# EAGLE board ELE3000.5 (EAGLE 6.1)
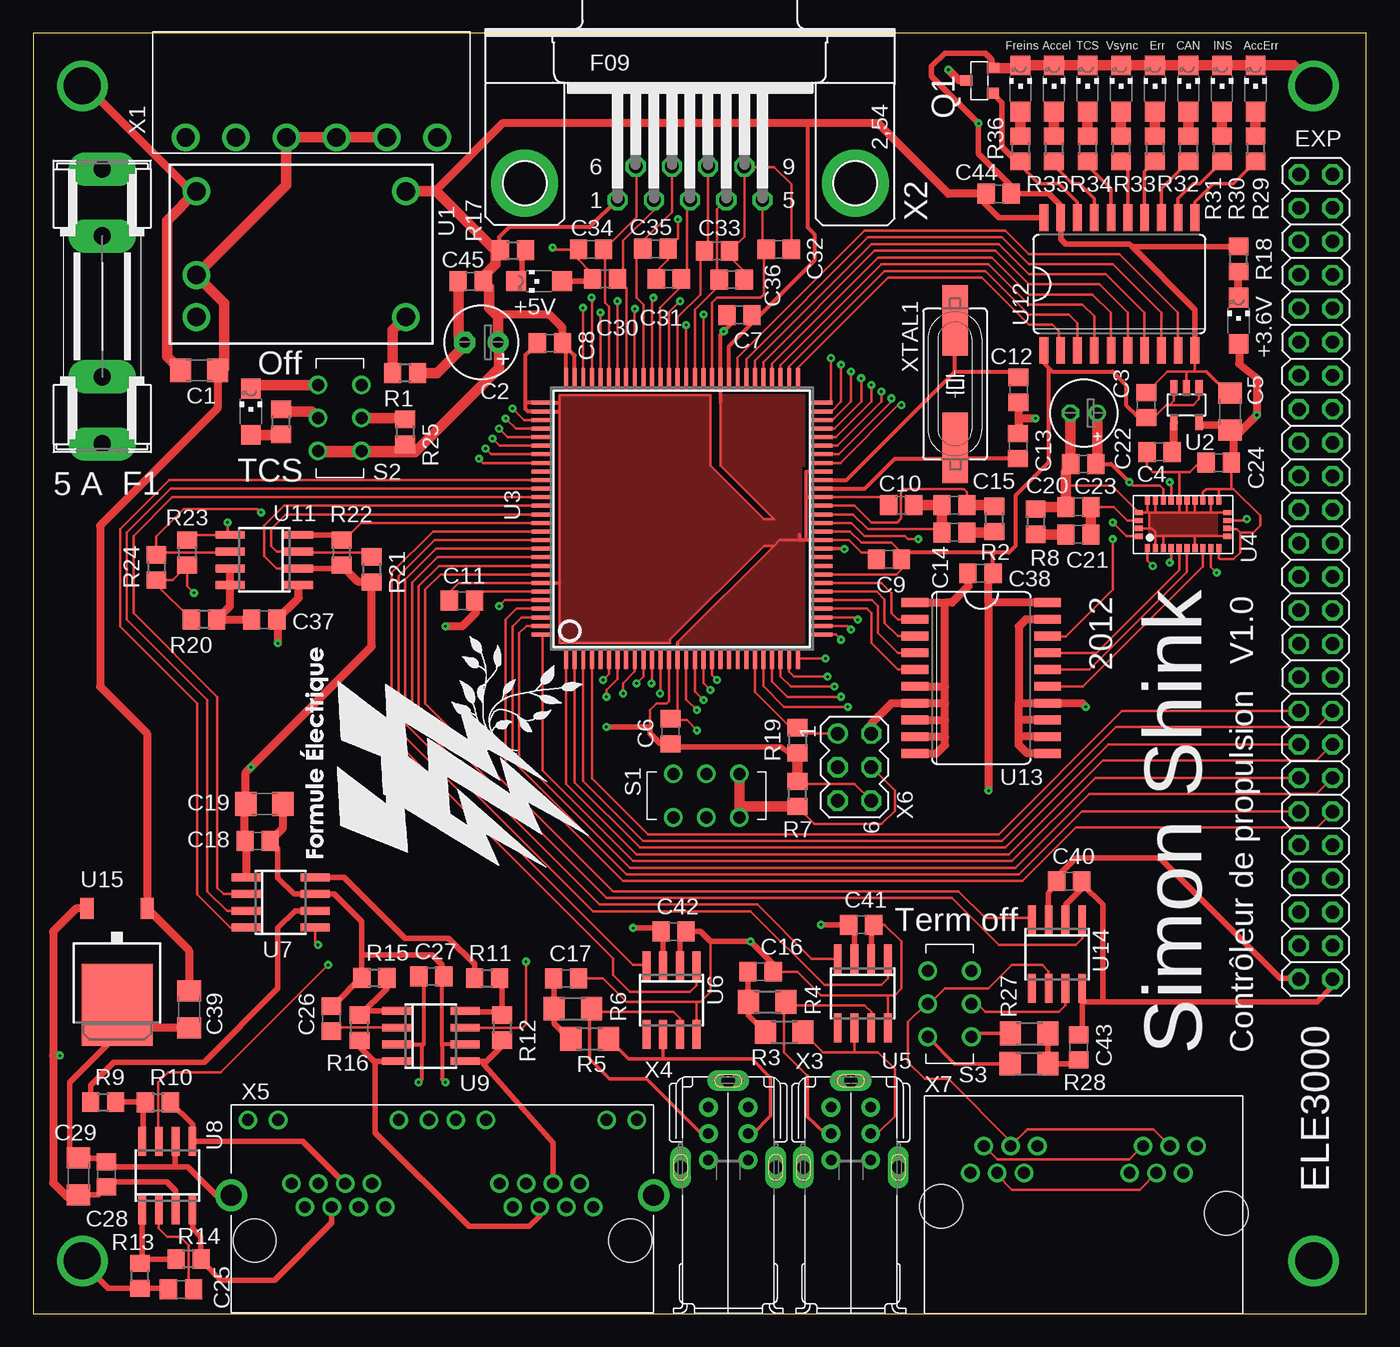
[diagram p5: board, top side]
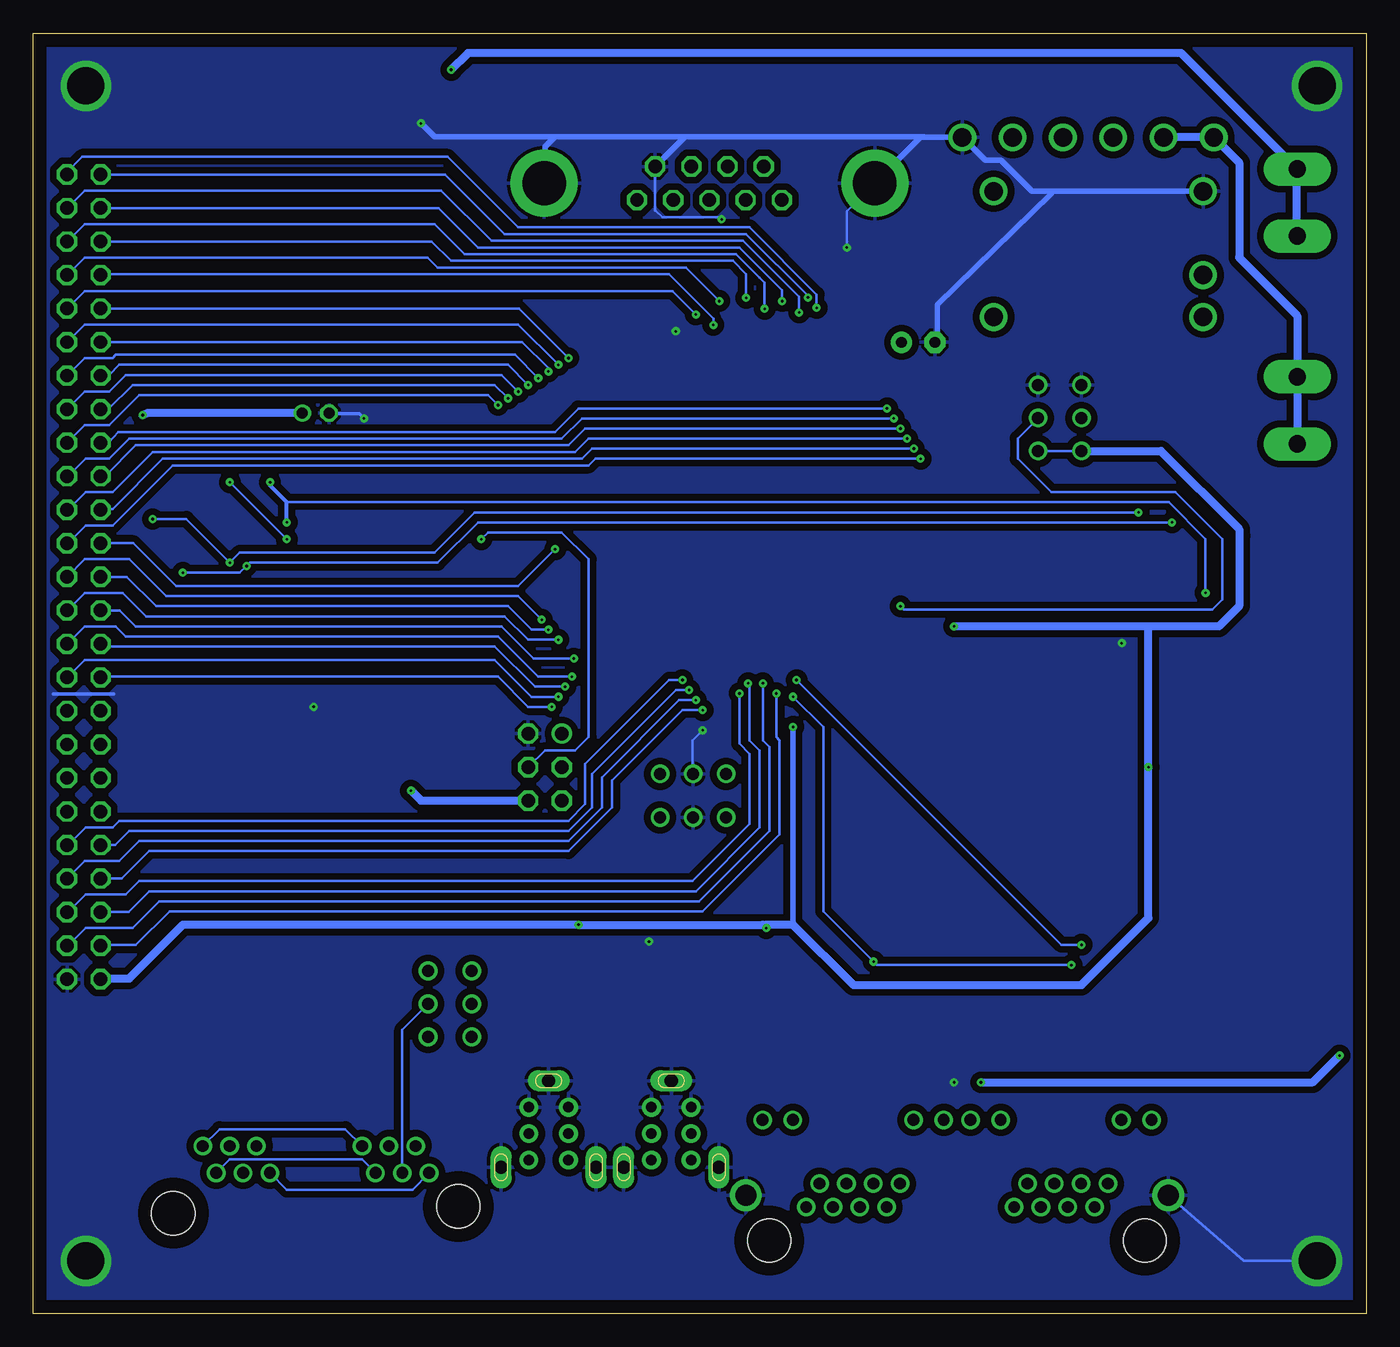
[diagram p6: board, bottom side, seen from below]

Size 101.02 x 97.02 mm. Coordinates in mm from the lower left corner, seen from the top.
Outline: 0,0 101.02,0 101.02,97.02 0,97.02 0,0
Copper layers (1*16): Top 0.035mm / dielectric 1.5mm / Bottom 0.035mm
Design rules: minimum track width 8mil, minimum drill 8mil, track to track 8mil, track to pad 8mil, pad to pad 8mil, via to via 8mil, smd to smd 8mil, copper to edge 40mil, drill to drill 8mil, minimum pad ring 10mil, minimum via ring 8mil, stop-mask expansion 5mil, vias tented up to drill 0mil, thermal gap 10mil

## Footprints (pad centres in the part's own frame; a part is rotated, then mirrored left to right if it is on the bottom)
CHIPLED_1206 = smd 1.5 x 1.5: A 0,-1.75; C 0,1.75
C1206 = smd 1.6 x 1.8: 1 -1.4,0; 2 1.4,0
E2,5-6 = drill 0.813 pad 1.6: + -1.27,0 | drill 0.813 pad 1.6 octagon: - 1.27,0
C0805 = smd 1.3 x 1.5: 1 -0.95,0; 2 0.95,0
E2-5 = drill 0.813 pad 1.27: + -1.016,0 | drill 0.813 pad 1.27 octagon: - 1.016,0
2X25 = drill 1.016 octagon: 1 -30.48,-1.27; 2 -30.48,1.27; 3 -27.94,-1.27; 4 -27.94,1.27; 5 -25.4,-1.27; 6 -25.4,1.27; 7 -22.86,-1.27; 8 -22.86,1.27; 9 -20.32,-1.27; 10 -20.32,1.27; 11 -17.78,-1.27; 12 -17.78,1.27; 13 -15.24,-1.27; 14 -15.24,1.27; 15 -12.7,-1.27; 16 -12.7,1.27; 17 -10.16,-1.27; 18 -10.16,1.27; 19 -7.62,-1.27; 20 -7.62,1.27; 21 -5.08,-1.27; 22 -5.08,1.27; 23 -2.54,-1.27; 24 -2.54,1.27; 25 0,-1.27; 26 0,1.27; 27 2.54,-1.27; 28 2.54,1.27; 29 5.08,-1.27; 30 5.08,1.27; 31 7.62,-1.27; 32 7.62,1.27; 33 10.16,-1.27; 34 10.16,1.27; 35 12.7,-1.27; 36 12.7,1.27; 37 15.24,-1.27; 38 15.24,1.27; 39 17.78,-1.27; 40 17.78,1.27; 41 20.32,-1.27; 42 20.32,1.27; 43 22.86,-1.27; 44 22.86,1.27; 45 25.4,-1.27; 46 25.4,1.27; 47 27.94,-1.27; 48 27.94,1.27; 49 30.48,-1.27; 50 30.48,1.27
SHK20L = drill 1.321 pad 2.54 long: 1A -10.414,0; 1B -5.334,0; 2A 10.414,0; 2B 5.334,0
MICRO3 = smd 0.8 x 0.9: 1 -0.95,-1; 2 0.95,-1; 3 0,1
R0805 = smd 1.3 x 1.5: 1 -0.95,0; 2 0.95,0
R1206 = smd 1.6 x 1.803: 1 -1.422,0; 2 1.422,0
JS202011CQN = drill 0.9: 1 -2.54,2.03; 2 -0.04,2.03; 3 2.46,2.03; 4 -2.54,-1.27; 5 -0.04,-1.27; 6 2.46,-1.27
EUS = drill 1.4: 1 -6.35,6.35; 2 -6.35,0; 3 -6.35,-3.175; 4 9.525,-3.175; 5 9.525,6.35
SOT23-5 = smd 0.55 x 1.2: 1 -0.95,-1.3; 2 0,-1.3; 3 0.95,-1.3; 4 0.95,1.3; 5 -0.95,1.3
SQFP-S-20X20-112 = smd 0.3 x 1.6: 1 -8.775,-10.6; 2 -8.125,-10.6; 3 -7.475,-10.6; 4 -6.825,-10.6; 5 -6.175,-10.6; 6 -5.525,-10.6; 7 -4.875,-10.6; 8 -4.225,-10.6; 9 -3.575,-10.6; 10 -2.925,-10.6; 11 -2.275,-10.6; 12 -1.625,-10.6; 13 -0.975,-10.6; 14 -0.325,-10.6; 15 0.325,-10.6; 16 0.975,-10.6; 17 1.625,-10.6; 18 2.275,-10.6; 19 2.925,-10.6; 20 3.575,-10.6; 21 4.225,-10.6; 22 4.875,-10.6; 23 5.525,-10.6; 24 6.175,-10.6; 25 6.825,-10.6; 26 7.475,-10.6; 27 8.125,-10.6; 28 8.775,-10.6; 57 8.775,10.6; 58 8.125,10.6; 59 7.475,10.6; 60 6.825,10.6; 61 6.175,10.6; 62 5.525,10.6; 63 4.875,10.6; 64 4.225,10.6; 65 3.575,10.6; 66 2.925,10.6; 67 2.275,10.6; 68 1.625,10.6; 69 0.975,10.6; 70 0.325,10.6; 71 -0.325,10.6; 72 -0.975,10.6; 73 -1.625,10.6; 74 -2.275,10.6; 75 -2.925,10.6; 76 -3.575,10.6; 77 -4.225,10.6; 78 -4.875,10.6; 79 -5.525,10.6; 80 -6.175,10.6; 81 -6.825,10.6; 82 -7.475,10.6; 83 -8.125,10.6; 84 -8.775,10.6 | smd 1.6 x 0.3: 29 10.6,-8.775; 30 10.6,-8.125; 31 10.6,-7.475; 32 10.6,-6.825; 33 10.6,-6.175; 34 10.6,-5.525; 35 10.6,-4.875; 36 10.6,-4.225; 37 10.6,-3.575; 38 10.6,-2.925; 39 10.6,-2.275; 40 10.6,-1.625; 41 10.6,-0.975; 42 10.6,-0.325; 43 10.6,0.325; 44 10.6,0.975; 45 10.6,1.625; 46 10.6,2.275; 47 10.6,2.925; 48 10.6,3.575; 49 10.6,4.225; 50 10.6,4.875; 51 10.6,5.525; 52 10.6,6.175; 53 10.6,6.825; 54 10.6,7.475; 55 10.6,8.125; 56 10.6,8.775; 85 -10.6,8.775; 86 -10.6,8.125; 87 -10.6,7.475; 88 -10.6,6.825; 89 -10.6,6.175; 90 -10.6,5.525; 91 -10.6,4.875; 92 -10.6,4.225; 93 -10.6,3.575; 94 -10.6,2.925; 95 -10.6,2.275; 96 -10.6,1.625; 97 -10.6,0.975; 98 -10.6,0.325; 99 -10.6,-0.325; 100 -10.6,-0.975; 101 -10.6,-1.625; 102 -10.6,-2.275; 103 -10.6,-2.925; 104 -10.6,-3.575; 105 -10.6,-4.225; 106 -10.6,-4.875; 107 -10.6,-5.525; 108 -10.6,-6.175; 109 -10.6,-6.825; 110 -10.6,-7.475; 111 -10.6,-8.125; 112 -10.6,-8.775
LGA-28 = smd 0.4 x 0.6: P$1 2.7,1.8; P$2 2.1,1.8; P$3 1.5,1.8; P$4 0.9,1.8; P$5 0.3,1.8; P$6 -0.3,1.8; P$7 -0.9,1.8; P$8 -1.5,1.8; P$9 -2.1,1.8; P$10 -2.7,1.8; P$15 -2.7,-1.8; P$16 -2.1,-1.8; P$17 -1.5,-1.8; P$18 -0.9,-1.8; P$19 -0.3,-1.8; P$20 0.3,-1.8; P$21 0.9,-1.8; P$22 1.5,-1.8; P$23 2.1,-1.8; P$24 2.7,-1.8 | smd 0.6 x 0.4: P$11 -3.35,0.9; P$12 -3.35,0.3; P$13 -3.35,-0.3; P$14 -3.35,-0.9; P$25 3.35,-0.9; P$26 3.35,-0.3; P$27 3.35,0.3; P$28 3.35,0.9
SO08 = smd 0.6 x 2.2: 1 -1.905,-2.6; 2 -0.635,-2.6; 3 0.635,-2.6; 4 1.905,-2.6; 5 1.905,2.6; 6 0.635,2.6; 7 -0.635,2.6; 8 -1.905,2.6
SO-08 = smd 0.6 x 2.2: 1 -1.905,-2.6; 2 -0.635,-2.6; 3 0.635,-2.6; 4 1.905,-2.6; 5 1.905,2.6; 6 0.635,2.6; 7 -0.635,2.6; 8 -1.905,2.6
SO20W = smd 0.66 x 2.032: 1 -5.715,-5.029; 2 -4.445,-5.029; 3 -3.175,-5.029; 4 -1.905,-5.029; 5 -0.635,-5.029; 6 0.635,-5.029; 7 1.905,-5.029; 8 3.175,-5.029; 9 4.445,-5.029; 10 5.715,-5.029; 11 5.715,5.029; 12 4.445,5.029; 13 3.175,5.029; 14 1.905,5.029; 15 0.635,5.029; 16 -0.635,5.029; 17 -1.905,5.029; 18 -3.175,5.029; 19 -4.445,5.029; 20 -5.715,5.029
DPACK_3 = smd 1 x 1.6: 1 -2.28,-4.8; 3 2.28,-4.8 | smd 5.4 x 6.2: 4 0,2.5
20020110-D061A0 = drill 1.4: P$1 -8.89,-3.81; P$2 -5.08,-3.81; P$3 -1.27,-3.81; P$4 2.54,-3.81; P$5 6.35,-3.81; P$6 10.16,-3.81
F09HP = drill 1.016 octagon: 1 -5.486,-1.27; 2 -2.743,-1.27; 3 0,-1.27; 4 2.743,-1.27; 5 5.486,-1.27; 6 -4.115,1.27; 7 -1.372,1.27; 8 1.372,1.27; 9 4.115,1.27 | drill 3.302 pad 5.08: G1 -12.522,0; G2 12.522,0
53460-0629 = drill 0.8 pad 1.422: 1 2,1.5; 2 2,-1.5; 3 0,1.5; 4 0,-1.5; 5 -2,1.5; 6 -2,-1.5 | drill 1 pad 1.6 long: S1 4,0; S2 -2.55,3.6; S3 -2.55,-3.6
RJHSE-5380-02 = drill 0.9: 1 11.684,0; 2 10.668,1.778; 3 9.652,0; 4 8.636,1.778; 5 7.62,0; 6 6.604,1.778; 7 5.588,0; 8 4.572,1.778; 9 14.986,6.604; 10 12.7,6.604; 11 3.556,6.604; 12 1.27,6.604; 13 -4.064,0; 14 -5.08,1.778; 15 -6.096,0; 16 -7.112,1.778; 17 -8.128,0; 18 -9.144,1.778; 19 -10.16,0; 20 -11.176,1.778; 21 -0.762,6.604; 22 -3.048,6.604; 23 -12.192,6.604; 24 -14.478,6.604 | drill 1.6: P$1 -15.748,0.889; P$2 16.256,0.889 | hole 3.251: -13.97,-2.54; 14.478,-2.54
MA03-2 = drill 1.016: 1 -2.54,-1.27 | drill 1.016 octagon: 2 -2.54,1.27; 3 0,-1.27; 4 0,1.27; 5 2.54,-1.27; 6 2.54,1.27
2*RJ11 = drill 0.9: 1 -9.22,3.048; 2 -8.204,5.08; 3 -7.188,3.048; 4 -6.172,5.08; 5 -5.156,3.048; 6 -4.14,5.08; 7 2.845,3.048; 8 3.861,5.08; 9 4.877,3.048; 10 5.893,5.08; 11 6.909,3.048; 12 7.925,5.08 | hole 3.302: 10.16,0; -11.43,0.508
HC49UP = smd 5.334 x 1.93: 1 -4.826,0; 2 4.826,0

## Placement (x,y rotation side)
+3.6V  3.6V  [CHIPLED_1206]  91.32,75.22 0 top
+5V  5V  [CHIPLED_1206]  38.34,78.21 90 top
C1  2.2 µF  [C1206]  12.58,71.47 180 top
C2  100 µF  [E2,5-6]  33.96,73.59 180 top
C3  1 µF  [C0805]  84.33,68.83 90 top
C4  470 pF  [C0805]  85.34,65.28 180 top
C5  4.7 µF  [C1206]  90.68,68.33 90 top
C6  220 nF  [C0805]  48.29,44.12 90 top
C7  220 nF  [C0805]  53.52,75.65 180 top
C8  >100 nF  [C0805]  39.15,73.53 180 top
C9  100 nF  [C0805]  64.85,57.15 180 top
C10  220 nF  [C0805]  65.77,61.25 180 top
C11  >100 nF  [C0805]  32.49,54.02 180 top
C12  18 pF  [C0805]  74.65,69.99 90 top
C13  18 pF  [C0805]  74.62,65.72 270 top
C14  4.7 nF  [C0805]  69.79,59.18 180 top
C15  470 pF  [C0805]  69.79,61.25 180 top
C16  47 nF  [C0805]  55.12,25.91 0 top
C17  47 nF  [C0805]  40.39,25.4 0 top
C18  0.1 µF  [C0805]  17.02,35.81 0 top
C19  10 µF  [C1206]  17.53,38.61 0 top
C20  10 nF  [C0805]  79.2,61.11 180 top
C21  470 nF  [C0805]  79.2,59.03 180 top
C22  10 µF  [E2-5]  79.6,68.22 180 top
C23  100 nF  [C0805]  79.55,64.36 180 top
C24  100 nF  [C0805]  89.81,64.47 180 top
C25  0.1 µF  [C0805]  11.22,1.84 180 top
C26  0.1 µF  [C0805]  22.61,22.35 90 top
C27  0.1 µF  [C0805]  30.18,25.55 0 top
C28  0.1 µF  [C0805]  5.56,10.57 90 top
C29  6.8 µF  [C1206]  3.45,10.42 90 top
C30  100 nF  [C0805]  43.33,78.38 180 top
C31  100 nF  [C0805]  48.16,78.38 180 top
C32  100 nF  [C0805]  56.49,80.62 0 top
C33  100 nF  [C0805]  52.93,78.33 0 top
C34  100 nF  [C0805]  42.27,80.62 0 top
C35  100 nF  [C0805]  47.14,80.67 180 top
C36  100 nF  [C0805]  51.82,80.52 180 top
C37  100 nF  [C0805]  17.53,52.58 0 top
C38  100 nF  [C0805]  71.78,56.08 180 top
C39  0.33 µF  [C1206]  11.83,23.06 270 top
C40  100 nF  [C0805]  78.49,32.77 0 top
C41  100 nF  [C0805]  62.74,29.46 0 top
C42  100 nF  [C0805]  48.51,28.96 0 top
C43  47 nF  [C0805]  79.21,20.18 270 top
C44  100 nF  [C0805]  73.15,84.84 0 top
C45  2.2 µF  [C0805]  33.16,78.21 180 top
EXP  Exp  [2X25]  97.17,55.82 270 top
F1  5 A  [SHK20L]  5.24,76.31 270 top
LED3  TCS off (rouge)  [CHIPLED_1206]  16.51,68.33 0 top
LED4  AccErr  [CHIPLED_1206]  92.61,92.81 0 top
LED5  INS  [CHIPLED_1206]  90.07,92.81 0 top
LED6  CAN  [CHIPLED_1206]  87.53,92.81 0 top
LED7  Err  [CHIPLED_1206]  84.99,92.81 0 top
LED8  Vsync  [CHIPLED_1206]  82.42,92.81 0 top
LED9  TCS  [CHIPLED_1206]  79.88,92.81 0 top
LED10  Accel  [CHIPLED_1206]  77.34,92.81 0 top
LED11  Freins  [CHIPLED_1206]  74.8,92.81 0 top
Q1  N-HEXFET_-IRLML6344TRPBF  [MICRO3]  71.7,93.41 90 top
R1  21K  [R0805]  28.19,71.25 180 top
R2  4.7K  [R0805]  72.83,60.21 90 top
R3  60  [R1206]  56.9,21.34 180 top
R4  60  [R1206]  55.63,23.62 180 top
R5  60  [R1206]  42.16,20.83 180 top
R6  60  [R1206]  40.89,23.11 180 top
R7  2K  [R0805]  57.91,39.37 90 top
R8  10 K  [R0805]  75.95,59.99 270 top
R9  400  [R0805]  5.31,16.03 0 top
R10  1K  [R0805]  9.46,16.02 0 top
R11  400  [R0805]  34.39,25.43 0 top
R12  1K  [R0805]  35.54,21.67 270 top
R13  400  [R0805]  8.11,2.88 90 top
R14  1K  [R0805]  11.79,4.14 180 top
R15  400  [R0805]  25.86,25.45 0 top
R16  1K  [R0805]  24.74,21.67 90 top
R17  280  [R0805]  36.36,80.56 0 top
R18  140  [R0805]  91.32,79.9 90 top
R19  1K  [R0805]  57.91,43.43 270 top
R20  200K  [R0805]  12.95,52.58 180 top
R21  1.3K  [R0805]  25.65,56.39 270 top
R22  1.3K  [R0805]  23.37,57.66 270 top
R23  1K  [R0805]  11.68,57.66 270 top
R24  1K  [R0805]  9.35,56.54 270 top
R25  10K  [R0805]  28.19,66.8 270 top
R26  300  [R0805]  18.8,67.56 90 top
R27  60  [R1206]  75.46,21.23 180 top
R28  60  [R1206]  75.45,18.94 180 top
R29  300  [R0805]  92.61,88.24 270 top
R30  300  [R0805]  90.07,88.24 270 top
R31  300  [R0805]  87.53,88.24 270 top
R32  300  [R0805]  84.99,88.24 270 top
R33  300  [R0805]  82.42,88.24 270 top
R34  300  [R0805]  79.88,88.24 270 top
R35  300  [R0805]  77.34,88.24 270 top
R36  300  [R0805]  74.8,88.24 270 top
S1  Reset  [JS202011CQN]  51.05,38.86 0 top
S2  TCS  [JS202011CQN]  22.86,67.82 270 top
S3  CAN_term  [JS202011CQN]  69.82,23.51 90 top
U1  PTN78000WAH  [EUS]  18.72,78.68 0 top
U2  MIC5219-3.6  [SOT23-5]  87.38,68.83 180 top
U3  MC9S12XD-112  [SQFP-S-20X20-112]  49.16,60.23 0 top
U4  LSM330DL  [LGA-28]  87.12,59.79 180 top
U5  TJA1050T  [SO08]  62.86,24.27 180 top
U6  TJA1050T  [SO08]  48.37,23.76 180 top
U7  MCP4822  [SO08]  18.76,31.16 270 top
U8  THS4130IDR  [SO-08]  10.17,10.46 0 top
U9  THS4130IDR  [SO-08]  30.14,21.04 270 top
U11  PCA9306D  [SO08]  17.53,57.1 90 top
U12  74LS245DW  [SO20W]  82.3,78 0 top
U13  74LS245DW  [SO20W]  71.83,48.16 270 top
U14  TJA1050T  [SO08]  77.57,27.24 180 top
U15  MC78M15CDTG  [DPACK_3]  6.37,25.9 180 top
X1  20020110-D061A01LF  [20020110-D061A0]  20.46,92.92 0 top
X2  Pédalier  [F09HP]  49.77,85.64 0 top
X3  53460-0629  [53460-0629]  61.96,13.64 90 top
X4  53460-0629  [53460-0629]  52.67,13.64 90 top
X5  RJHSE-5380-02  [RJHSE-5380-02]  30.76,8.08 0 top
X6  BKGD  [MA03-2]  62.23,41.4 270 top
X7  0438146621  [2*RJ11]  80.23,7.62 0 top
XTAL1  16 MHz  [HC49UP]  69.85,70.42 90 top

## Tracks (layer width: path | path; a pad name or v marks a point on that pad's centre or on a via)
+3V3  (via drill 0.2)
  Top 0.203: U4.P$28 82.84,58.89 v81.79,59.94 | U4.P$10 89.82,57.24 89.92,57.15 90.93,57.15 91.44,57.66 91.44,59.18 | U4.P$12 90.53,59.44 91.19,59.44 91.44,59.18 | U4.P$15 89.82,62.32 89.92,62.48 | 89.92,62.48 88.88,62.48 88.62,62.23 U4.P$17 | U4.P$22 85.62,62.46 85.34,62.74 83.31,62.74 v83.06,62.99 | 91.06,66.55 90.93,66.42 | 90.93,64.52 90.82,64.52 C24.1 90.76,62.57 90.68,62.48 | 90.68,62.48 90.93,62.48 92.96,60.45 92.96,59.69 92.46,59.18 91.44,59.18 | 90.68,62.48 89.92,62.48 | R20.2 9.35,55.23 R24.2 10.57,55.59 R23.2 11.68,55.12 v12.19,54.61
  Top 0.254: C23.1 80.62,64.48 | +3.6V.A 91.38,73.47 | 91.19,66.55 91.06,66.55 C5.1 90.07,67.28
  Top 0.305: C23.1 81.69,64.36 v83.06,62.99
  Top 0.406: 88.39,67.31 88.33,67.38 U2.5
  Top 0.61: 91.38,73.47 91.38,71.94 92.71,70.87 v92.71,68.07 91.19,66.55 | 90.07,67.28 88.39,67.31 | 90.93,66.42 90.93,64.52
  Top 0.813: 80.62,64.48 C22.+
  Bottom 0.203: v12.19,54.61 12.19,58.67 14.99,61.47 81.79,61.47
  Bottom 0.305: v83.06,62.99 83.06,62.74 81.79,61.47 v81.79,59.94
  Bottom 0.61: C22.+ 92.3,68.22 v92.71,68.07
+5V  (via drill 0.2)
  Top 0.203: U3.41 61.9,59.25 62.74,58.42 65.02,58.42 65.79,57.66 | U3.36 65.4,56 66.04,56.64 65.8,56.89 C9.1 65.8,57.65 65.79,57.66 | 40.38,73.25 C8.1 | X2.1 44.24,84.37 | 35.31,80.66 R17.1 | U2.1 88.33,69.28 87.88,68.83 86.11,68.83 | 86.11,68.83 85.85,68.83 84.84,67.82 84.39,67.82 C3.1 84.14,68.07 | U2.3 86.43,69.15 86.11,68.83 | U12.1 76.58,72.01 | 66.04,57.66 65.79,57.66 | C44.1 71.63,84.84 | U3.107 34.13,54.7 33.53,54.1 | 23.12,56.46 R22.2 | U3.97 19.04,61.2 17.53,59.69 17.53,57.4 18.47,56.46 U11.2 | C19.1 16,38.48 | 16.16,35.72 C18.1 16,35.81 | 62.23,29.02 C41.1 | 47.73,28.79 C42.1 47.31,29.21 | 54.61,75.53 C7.1 | X6.6 62.23,40.13 58.42,40.13 58.17,40.39 57.91,40.39 R7.2 | 46.74,44.45 46.74,45.72 47.24,46.23 48.01,46.23 48.18,46.41 U3.13 | 48.28,43.18 C6.1 48.54,42.93 | 57.4,42.42 57.78,42.42 57.85,42.48 R19.2 | R25.2 28.38,65.85 | C40.1 77.47,32.51 77.47,33.02 | C38.1 72.73,55.71 72.39,55.37 | 35.31,73.66 C2.+
  Top 0.254: 66.04,57.66 65.79,57.4 | 76.58,72.01 76.45,72.14 | C11.1 33.53,54.1
  Top 0.305: U3.84 40.38,73.25 | 44.24,84.37 42.16,82.3 36.07,82.3 35.31,81.53 35.31,80.66 | U3.83 41.03,72.59 C8.1 | 35.48,75.69 35.23,75.44 | 76.96,71.63 77.22,71.37 81.79,71.37 82.8,70.36 82.8,68.83 83.57,68.07 84.14,68.07 | 72.64,57.66 73.91,57.66 74.42,58.17 74.42,61.98 76.96,64.52 76.96,71.63 | 72.64,57.66 66.04,57.66 | 76.96,71.63 76.58,72.01 | U3.65 52.73,73.31 54.61,75.18 | 54.61,75.18 54.61,75.53 | 58.67,90.17 58.67,82.3 59.18,81.79 59.18,79.76 55.08,75.65 | C7.1 55.08,75.65 | 55.08,75.65 54.61,75.18 | C38.1 72.73,57.57 72.64,57.66
  Top 0.406: U12.20 73.18,83.03 71.88,84.33 72.2,84.65 C44.1 | 30.42,85.03 30.48,85.09 | 35.23,75.44 35.23,75.52 | 35.31,80.66 35.19,80.66 35.05,80.52 | 34.29,78.74 34.29,78.39 C45.1 | U11.2 23.12,56.46 | U5.3 62.23,29.02 | U6.3 47.73,28.79 | U14.3 76.94,31.84 C40.1 | 48.28,43.18 47.5,43.18 46.74,43.94 46.74,44.45 v43.43,44.45 | 48.54,42.93 56.64,42.93 57.4,42.42 | 47.31,29.21 v45.47,29.21 | C41.1 v59.69,29.46 | 77.47,33.02 78.99,34.54 85.34,34.54 94.49,25.4 95.84,25.4 EXP.49
  Top 0.61: 71.63,84.84 69.34,84.84 64.01,90.17 58.67,90.17 35.56,90.17 30.48,85.09 | 34.54,77.78 C45.1 | C8.1 40.1,74.7 39.12,75.69 35.48,75.69 | R22.2 24.64,55.44 R21.2 25.65,50.55 v16.51,41.4 16.13,41.02 C19.1 | 16,38.48 16,35.81 | 16.16,35.72 U7.1 | 33.53,54.1 33.53,53.09 32.51,52.07 v31.24,52.07 | 72.39,53.85 v72.39,39.62 | U13.20 72.42,53.87 72.39,53.85 | 72.39,53.85 72.39,55.37
  Top 0.813: U1.5 30.42,85.03 | 30.48,85.09 35.05,80.52 35.05,79.5 34.29,78.74 | C2.+ 35.23,75.44 | 35.23,75.52 34.54,76.2 34.54,77.78 | 57.91,40.39 R19.2 | S2.6 S2.3 27.7,65.36 R25.2 28.19,65.28 | 35.31,73.66 35.31,71.63 28.96,65.28 28.19,65.28 | 28.19,65.28 21.59,65.28
  Bottom 0.203: 9.65,59.44 9.4,58.93 | S2.6 24.81,65.36 24.89,65.28
  Bottom 0.406: 43.43,29.46 v43.43,44.45 | EXP.49 95.84,25.4
  Bottom 0.61: 45.72,29.46 v59.69,29.46 89.66,29.46 93.73,25.4 95.84,25.4 | 45.72,29.46 v45.47,29.21 45.47,29.46 | S2.6 15.57,65.36 9.65,59.44 9.65,53.59 11.18,52.07 16.51,52.07 | 16.51,52.07 v31.24,52.07 | 16.51,52.07 v16.51,41.4 16.51,29.97 21.59,24.89 38.86,24.89 43.43,29.46 45.21,29.46 45.47,29.46 | v72.39,39.62 71.63,38.86 X6.6 | 45.72,29.46 45.47,29.46
+15V  (via drill 0.2)
  Top 0.203: 3.56,8.89 3.45,9 C29.1
  Top 0.254: 5.45,10.01 C28.1 | U9.3 27.56,20.42 | 29.62,25.55 C27.1 | 2.54,8.89 3.56,8.89 | 29.62,20.42 29.46,20.32
  Top 0.305: 27.56,20.42 29.62,20.42 29.62,25.55 | v29.21,17.53 29.46,17.78 29.46,20.32
  Top 0.406: U8.3 10.81,9.31 10.11,10.01 5.45,10.01 | C28.1 4.96,9.02 C29.1
  Top 0.61: 1.52,19.56 1.52,28.96 3.27,30.7 U15.3 | 1.52,19.56 1.52,9.91 2.54,8.89 | v2.03,19.56 1.52,19.56
  Bottom 0.61: v29.21,17.53 4.06,17.53 v2.03,19.56
+24V
  Top 0.203: C1.1 14.32,71.47 14.48,71.63 | U15.1 8.65,30.72 8.64,30.73
  Top 0.61: U15.1 11.83,27.52 C39.1 | C1.1 13.98,68.59 5.08,59.69 5.08,47.5 8.64,43.94 8.64,30.73
  Top 0.813: X1.P$5 X1.P$4 X1.P$3 19.19,85.49 U1.2 14.48,76.57 14.48,71.63
ACCEL1
  Top 0.203: X2.3 49.53,84.12 49.53,78.99 49.11,78.57 C31.1 49.02,78.3 49.02,77.72 47.5,76.2 47.5,70.87 U3.73
ACCEL2
  Top 0.203: 51.56,78.33 C33.1 | X2.4 51.82,83.67 51.82,78.5 C33.1 | U3.69 50.13,76.04 51.98,77.89 C33.1
BKGD
  Top 0.203: X6.1 57.98,43.94 R19.1 57.91,44.45 57.34,44.45 54.68,47.1 U3.23
CANH_D
  Top 0.203: U6.7 49,22.37 48.51,22.86 42.57,22.86 R6.1
  Top 0.254: X4.3 50.62,13.64 46.48,17.78 43.69,17.78 42.16,19.3 42.16,23.11 R6.1
CANH_G
  Top 0.203: U5.7 63.5,22.86 62.99,23.37 57.3,23.37 R4.1 56.9,23.47 56.9,19.81 58.67,18.03
  Top 0.254: X3.3 60.02,13.64 59.94,13.72 58.67,14.91 58.67,18.03
CANL_D
  Top 0.254: X4.4 54.53,13.64 55.88,14.99 55.88,17.88 54.46,19.3 47.75,19.3 | U6.6 47.73,19.32 47.75,19.3 | 47.75,19.3 45.11,19.3 R5.1
CANL_G
  Top 0.203: U5.6 62.23,19.82 62.23,19.81 | 62.23,19.81 59.84,19.81 R3.1 | X3.4 63.93,13.64 64.01,13.72 65.28,14.95 65.28,18.54 64.01,19.81 62.23,19.81
FREINS
  Top 0.203: X2.2 47.03,83.61 44.7,81.28 44.7,78.49 | 44.68,77.98 44.96,77.71 44.96,70.87 44.93,70.84 U3.77
  Top 0.254: 44.68,77.98 C30.1 44.6,78.38 44.7,78.49
GND  (via drill 0.2, 2.8)
  Top 0.203: 58.55,61.85 58.56,61.85 | C31.2 47.21,78.96 48.09,79.84 C35.1 48.84,81.42 v48.84,82.91 | C33.2 53.85,78.37 53.85,78.99 52.77,80.08 C36.1 52.83,80.52 53.89,81.58 X2.9 53.85,86.87 | U3.45 64.21,61.85 C10.2 | C9.2 63.64,57.66 | U3.40 61.79,58.6 62.74,57.66 63.64,57.66 | C32.2 57.44,85.56 56.13,86.87 53.85,86.87 | 53.85,86.87 | v39.37,80.77 39.52,80.62 C34.1 41.32,79.84 42.16,78.99 42.16,78.6 C30.2 42.32,78.38 42.14,78.21 | U12.10 88.01,71.5 87.88,71.37 | C3.2 85.92,71.37 87.38,71.37 | 84.42,60.87 U4.P$24 84.42,60.79 84.33,60.69 | U4.P$20 86.82,60.75 | U4.P$19 87.42,60.71 | U4.P$18 88.02,60.69 | U4.P$14 90.46,60.71 90.42,60.71 90.41,60.69 89.15,60.69 | U4.P$11 90.44,58.93 88.02,58.93 | 83.83,59.44 U4.P$27 84.58,59.49 | C23.2 78.23,63.74 | R8.1 76.11,61.11 | C20.2 78.23,61.13 | U4.P$25 81.73,62.74 78.23,62.74 | 88.9,71.37 87.88,71.37 | 87.88,71.37 87.38,71.37 | U2.2 87.38,71.37 | C4.2 84.39,64.2 84.84,63.75 86.87,63.75 | 86.87,63.75 87.63,63.75 88.14,64.26 88.65,64.26 88.85,64.47 C24.2 | U4.P$20 86.82,63.71 86.87,63.75 | 5.74,11.12 5.56,11.46 C28.2 | 3.45,11.79 C29.2 3.45,11.83 3.56,11.94 2.79,11.94 | U13.14 76.84,46.23 76.2,46.23 | 69.06,46.25 69.09,46.23 | 69.06,47.52 69.09,47.5 | 69.11,53.87 69.09,53.85 | 70.87,56.13 70.87,56.12 C38.2 | 64.01,57.66 63.64,57.66 | U4.P$25 84.33,60.69 | 84.33,60.69 85.09,60.69 | 85.09,60.69 87.88,60.69 | 88.02,60.69 89.15,60.69 | U4.P$16 89.22,60.77 89.15,60.71 89.15,60.69 | U4.P$23 85.02,60.76 85.09,60.69 | 84.58,59.49 84.77,59.49 85.02,59.24 85.02,58.93 | 85.02,58.93 U4.P$2 | U4.P$25 84.58,60.69 84.58,59.49 | 88.02,58.93 85.62,58.93 | 85.62,58.93 85.02,58.93 | U4.P$7 88.02,58.93 | U4.P$3 85.62,58.93
  Top 0.203: U4.P$20 86.82,60.71 87.42,60.71 | 88.02,60.69 87.88,60.69 | 87.88,60.69 87.88,60.71 87.42,60.71 | 69.06,43.71 69.09,43.69 | 69.06,44.98 69.09,44.96 | 74.7,43.71 74.68,43.69 | 74.7,44.98 74.68,44.96 | 8.11,21.66 U15.4 6.35,23.38 6.35,21.08 | 52.83,74.93 52.83,75.69 52.79,75.65 C7.2 | U3.106 32.24,55.35 31.5,54.61 31.5,54.06 C11.2 | U5.8 64.77,23.37 64.77,23.62 64.77,24.13 | 64.77,24.13 59.69,24.13 57.91,25.91 C16.2 56.07,26.48 | 63.5,29.27 C41.2 64.52,29.46 65.79,28.19 65.79,24.64 65.28,24.13 64.77,24.13 | 51.31,28.19 51.31,24.38 50.55,23.62 50.29,23.62 | 50.29,23.62 44.96,23.62 43.18,25.4 C17.2 | 49,28.5 C42.2 | U6.8 50.27,23.6 50.29,23.62 | 78.97,21.37 C43.1 79.25,21.09 79.25,21.08 79.48,21.31 | C40.2 79.5,32.51 79.5,32.26 | U14.8 79.5,24.62 79.5,23.62 | 66.78,46.23 U13.7 | U14.2 78.23,29.87 | U3.14 48.84,45.28 48.51,44.96 49.53,44.96 v50.29,44.2 | 16.79,70.36 LED3.C | 48.84,50.8 48.84,50.87 56.13,58.17 | 56.13,58.17 56.57,58.6 58.06,58.6 | 56.13,58.17 55.37,58.17 48.26,51.05 48.26,50.8 39.88,50.8 39.88,55.37 39.88,69.1 | 52.07,69.09 52.07,64.26 56.13,60.2 55.37,60.2 51.31,64.26 51.31,69.6 39.88,69.6 39.88,69.1 | 39.81,69.03 39.88,69.1 | 31.09,20.42 30.99,20.32 | C37.2 18.48,52.14 18.54,52.07 | 24.89,25.5 24.89,25.47 R15.1 | 32.26,78.23 32.23,78.23 C45.2 | 59.79,63.8 U3.48
  Top 0.254: U3.45 58.56,61.85 58.56,63.8 59.79,63.8 | U3.40 58.55,58.6 | 58.55,58.6 58.55,61.85 | U3.14 48.84,50.8 | U3.86 | 39.78,69 39.81,69.03 | 58.55,58.6 58.06,58.6 58.06,59.03 | U3.66 52.09,69.04 | 37.34,69 37.31,69.03 | 8.19,1.84 R13.1 | U8.6 10.77,13.02 | 5.74,11.12 5.08,11.79 | C26.2 22.67,23.37 22.76,23.37 | U9.6 32.72,20.42 | 30.99,24.89 31.12,25.03 C27.2 | C23.2 78.59,64.38 | C25.2 10.18,1.93 | 3.81,3.81 3.81,3.94 v3.75,4 | C12.1 74.73,69.04 | C5.2 90.55,69.73 88.9,71.37 | U3.106 39.86,55.35 39.88,55.37
  Top 0.305: 74.65,66.7 C13.1 74.68,66.73 | U3.86 39.8,68.35 | 39.78,69 U3.85 37.34,69 | U3.86 37.48,68.35 37.31,68.53 37.31,69.03 37.31,72.63 C8.2 | 32.72,20.42 31.09,20.42 | 30.99,24.89 30.99,20.32 30.99,17.78 v31.24,17.53 | U3.66 52.09,74.18 v52.32,74.42 52.83,74.93 | Q1.2 72.64,94.42 72.64,94.74 | 32.77,73.41 32.77,73.51 C2.- | 83.23,80.85 83.19,80.9 | C27.2 30.99,25.69 30.99,26.42 | 10.77,11.23 10.67,11.12
  Top 0.406: 10.77,13.02 10.77,11.23 | 5.74,11.12 10.67,11.12 11.73,11.12 13.89,8.97 X5.P$1 | 5.08,11.79 3.45,11.79 | 22.76,23.37 24.89,25.5 24.89,27.18 | 74.6,94.36 LED11.C | U12.10 88.01,76.07 83.19,80.9 83.06,81.03 78.23,81.03 77.85,81.41 U12.19 77.85,83.95 76.96,84.84 C44.2 74.1,85.41 71.63,87.88 v71.63,90.17 68.07,93.73 68.07,94.49 69.09,95.5 72.14,95.5 72.64,95 72.64,94.74 | 10.18,1.93 R13.1 5.69,1.93 3.81,3.81 | +5V.A 42.14,78.21 | U1.1 12,85.03 | R18.2 83.23,80.85 | 24.89,27.18 30.23,27.18 30.99,26.42 | 2.79,11.94 2.79,17.53 6.35,21.08 | C18.2 18.54,35.24 18.54,33.02 19.77,31.79 U7.7 22.82,31.79 24.89,29.72 24.89,27.18 | U5.2 63.5,29.27 | C42.2 50.55,28.96 51.31,28.19 v54.36,28.19 56.07,26.48 | U6.2 49,28.5 | 79.5,32.51 81.03,30.99 81.03,23.62 | 78.23,29.87 78.23,30.99 79.5,32.26 | U14.8 79.48,21.31 | 48.51,44.96 48.4,45.07 C6.2 | 81.03,23.62 97.28,23.62 98.44,24.78 EXP.50 | 81.03,23.62 79.5,23.62
  Top 0.61: C12.1 74.65,66.7 | 12,85.03 5.02,92.01 v3.75,93.02 | U13.1 69.11,53.87 69.62,53.87 70.87,55.12 70.87,56.12 | 74.68,46.23 76.2,46.23 79.5,46.23 v79.76,45.97 | U13.7 69.06,46.25 | U13.6 69.06,47.52 | 69.09,53.85 69.09,47.5 69.09,46.23 69.09,44.96 69.09,43.69 69.09,43.08 68.45,42.44 U13.10 | U13.9 69.06,43.71 | U13.8 69.06,44.98 | U13.11 75.31,42.44 74.68,43.08 74.68,43.69 74.68,44.96 74.68,46.23 | U13.12 74.7,43.71 | U13.13 74.7,44.98 | C39.2 8.11,21.66 | C37.2 20.13,54.23 U11.1 | C19.2 18.93,36.77 C18.2 | 66.78,46.23 65.02,46.23 63.5,44.7 X6.2 | 18.54,52.07 v18.54,50.8 | U13.19 75.21,52.6 74.68,52.07 74.68,46.23 | v75.95,67.82 74.68,67.82 74.68,66.73
  Top 0.813: 78.59,64.38 C22.- | LED11.C LED10.C LED9.C LED8.C LED7.C LED6.C LED5.C LED4.C 95.47,94.56 v97.02,93.02 | Q1.2 74.6,94.36 | C1.2 10.16,72.49 10.16,82.82 U1.1 | R1.1 30.61,71.25 32.77,73.41 | C2.- 32.26,74.02 32.26,78.23 | 78.23,63.74 78.23,62.74 78.23,61.13 | 76.11,61.11 C20.2 | S2.4 16.79,70.36
  Bottom 0.203: v3.75,4 9.28,4 X5.P$1 | X2.G1 39.37,83.52 v39.37,80.77 | X2.9 53.89,83.57 53.85,83.57 53.34,83.06 49,83.06 v48.84,82.91 | v50.29,44.2 51.05,43.43 51.05,40.89 S1.2
  Bottom 0.254: v75.95,67.82 76.33,68.2 78.59,68.2 | 99.49,46.94 94.92,46.94
  Bottom 0.406: X1.P$6 33.53,89.11 | 33.53,89.11 33.78,89.11 X2.G1 | X1.P$6 30.62,89.04 30.48,88.9 | U1.1 24.07,85.03 | X1.P$6 28.88,87.38 27.69,87.38 25.34,85.03 24.07,85.03 | 32.51,73.66 32.51,76.45 23.88,84.84 24.07,85.03 | 51.64,89.15 33.53,89.15 33.53,89.11 | 51.64,89.15 X2.9 | 51.64,89.15 61.47,89.15 | 61.47,89.15 70.61,89.15 v71.63,90.17 | 62.23,85.6 62.23,88.39 61.47,89.15
  other vias: 97.02,4
  pour Bottom (isolate 0.508): 0.51,96.52 100.33,96.52 100.58,96.27 100.58,0.76 100.33,0.51 0.51,0.51
  pour Top (isolate 0.305): 84.58,60.71 89.66,60.71 89.66,58.93 84.58,58.93
  pour Top: 39.88,69.6 39.88,50.8 48.26,50.8 48.26,51.05 55.37,58.17 56.13,58.17 48.77,50.8 58.42,50.8 58.42,58.67 58.17,58.67 58.17,64.26 58.42,64.26 58.42,69.6 52.07,69.6 52.07,64.26 56.13,60.2 55.37,60.2 51.31,64.26 51.31,69.6
IOC0  (via drill 0.2)
  Top 0.203: U3.9 45.59,48.63 44.7,47.75 v44.7,46.99
  Bottom 0.203: EXP.47 95.7,27.94 93.22,27.94 90.68,30.48 50.29,30.48 44.45,36.32 44.45,43.43 44.7,43.69 v44.7,46.99
IOC1  (via drill 0.2)
  Top 0.203: U3.10 46.23,48.27 v45.72,47.75
  Bottom 0.203: EXP.48 98.36,27.88 97.03,29.21 93.47,29.21 91.44,31.24 50.55,31.24 45.21,36.58 45.21,42.93 45.72,43.43 v45.72,47.75
IOC2  (via drill 0.2)
  Top 0.203: U3.11 46.88,47.86 v46.84,47.75
  Bottom 0.203: EXP.45 93.78,30.42 92.2,32 50.8,32 45.97,36.83 45.97,42.67 46.74,43.43 46.74,47.5 v46.84,47.75
IOC3  (via drill 0.2)
  Top 0.203: U3.12 47.53,47.03 v47.5,46.99
  Bottom 0.203: EXP.46 98.36,30.42 97.03,31.75 93.98,31.75 92.96,32.77 51.05,32.77 46.74,37.08 46.74,42.42 47.5,43.18 v47.5,46.99 47.5,46.74
IOC4  (via drill 0.2)
  Top 0.203: U3.15 49.48,46.53 v50.29,45.72
  Bottom 0.203: v50.29,45.72 51.82,45.72 57.15,40.39 57.15,38.35 60.45,35.05 92.2,35.05 94.29,32.96 EXP.43
IOC5  (via drill 0.2)
  Top 0.203: U3.16 50.13,47.15 v50.8,46.48
  Bottom 0.203: v50.8,46.48 52.07,46.48 57.91,40.64 57.91,38.35 60.45,35.81 92.96,35.81 94.49,34.29 97.11,34.29 EXP.44
IOC6  (via drill 0.2)
  Top 0.203: U3.17 50.78,47.77 v51.31,47.24
  Bottom 0.203: v51.31,47.24 52.32,47.24 58.67,40.89 58.67,38.35 60.45,36.58 93.73,36.58 94.8,35.5 EXP.41
IOC7  (via drill 0.2)
  Top 0.203: U3.18 51.43,48.39 v51.82,48.01
  Bottom 0.203: v51.82,48.01 52.83,48.01 59.18,41.66 59.18,38.61 60.45,37.34 94.49,37.34 95,36.83 97.03,36.83 98.3,35.56 98.38,35.56 EXP.42
K1
  Top 0.203: X2.5 55.26,80.9 C32.1 55.37,80.45 55.37,77.22 55.12,76.96 51.82,76.96 51.43,76.58 U3.67
K2
  Top 0.203: X2.6 45.72,86.85 45.72,83.06 43.18,80.52 | 43.33,80.39 43.33,76.58 43.64,76.28 43.64,70.94 43.63,70.94 U3.79
  Top 0.254: 43.33,80.39 43.18,80.52 43.22,80.55 C34.2
K3
  Top 0.203: 45.72,79.94 C35.2 46.19,80.48 46.23,80.52 46.23,81.28 48.4,83.45 X2.7 | 45.72,79.94 45.72,76.96 46.23,76.45 U3.75 | 45.72,79.94 45.72,80.01
K4
  Top 0.203: X2.8 51.15,80.8 C36.2 50.55,80.2 50.55,77.22 48.84,75.5 U3.71
L-FREINS
  Bottom 0.203: X1.P$2 15.36,89.11
  Bottom 0.406: 15.36,89.11 X1.P$2
  Bottom 0.61: 15.36,89.11 X1.P$1 9.65,87.19 9.65,80.01 5.24,75.6 F1.2A
MOSI0
  Top 0.203: U3.94 10.32,63.15 6.6,59.44 6.6,52.07 12.45,46.23 12.45,31.75 14.95,29.25 U7.4
N$1
  Top 0.813: R1.2 27.24,74.5 U1.4
N$2
  Top 0.203: C4.1 86.43,65.41
  Top 0.61: 86.43,65.41 U2.4
N$3
  Top 0.254: 74.8,87 76.2,85.6 77.72,85.6 79.12,84.2 U12.18
  Top 0.406: 74.8,87 R36.2 74.51,87.29 73.41,88.39 73.41,91.75 Q1.1
N$4  (via drill 0.2)
  Top 0.203: U4.P$21 86.22,62.88 v86.11,62.99 | v81.79,58.67 81.79,54.86 78.23,51.31 76.96,51.31 76.94,51.33 U13.18
  Bottom 0.203: v86.11,62.99 v81.79,58.67
N$5
  Top 0.203: 74.17,71.37 74.65,70.89 | C12.2 74.65,70.89 | 74.65,70.89 74.68,70.87 | XTAL1.2
  Top 0.305: U3.47 61.63,63.15 69.85,71.37 | 69.85,71.37 XTAL1.2 | 69.85,71.37 74.17,71.37
N$6
  Top 0.203: U3.43 62.13,60.55 63.25,59.44 68.59,59.44 C14.2
  Top 0.305: 66.7,61.25 C10.1 | C14.2
  Top 0.813: 66.7,61.25 C15.2 C14.2
N$7
  Top 0.305: 72.75,59.18 R2.1
  Top 0.813: C14.1 72.75,59.18
N$8
  Top 0.203: C15.1 70.74,62.25 70.51,62.48 66.01,62.48 65.76,62.23 65.76,60.23 65.47,59.94 63.5,59.94 62.24,61.2 U3.44
  Top 0.305: 72.75,61.25 R2.2
  Top 0.813: C15.1 72.75,61.25
N$9
  Top 0.203: 19.3,68.33 19.12,68.51 R26.2
  Top 0.813: S2.5 21.12,68.33 19.3,68.33
N$10
  Top 0.203: U4.P$5 86.82,56.34 80.54,50.06 U13.17
N$11
  Top 0.203: XTAL1.1 69.85,65.53
  Top 0.305: U3.46 63.01,62.5 65.28,64.77 69.03,64.77 XTAL1.1 | C13.2 70.61,64.77 69.85,65.53
N$12
  Top 0.203: U4.P$6 87.42,56.18 80.04,48.79 U13.16
N$13
  Top 0.203: U4.P$8 88.62,56.62 79.53,47.52 U13.15
N$14
  Top 0.203: 39.47,25.36 C17.1 | R5.2 40.64,20.83
  Top 0.406: 39.47,25.36 R6.2 39.47,22 40.64,20.83
N$15
  Top 0.203: R26.1 18.76,66.58
  Top 0.813: 18.76,66.58 LED3.A
N$16
  Bottom 0.203: X7.1 72.28,9.4 81.79,9.4 83.06,10.67 X7.7
N$17  (via drill 0.2)
  Top 0.61: Q1.3 70.17,93.41 v69.34,94.23
  Bottom 0.203: 5.33,86.87 5.33,86.81 F1.1A
  Bottom 0.61: F1.1A 14.03,95.5 68.07,95.5 v69.34,94.23 | 5.33,86.87 5.33,81.53
N$18
  Top 0.203: 54.17,23.66 R4.2
  Top 0.406: C16.1 54.17,23.66 | R4.2 54.2,22.61 R3.2
N$19
  Top 0.203: X7.2 73.04,11.68 83.06,11.68 84.07,12.7 X7.8
N$20
  Top 0.203: X7.3 73.04,10.53 74.17,9.4 83.84,9.4 X7.9 | S3.5 71.53,23.47 72.14,22.86 77.72,22.86 78.2,23.34 U14.7
  Bottom 0.203: X7.3 73.04,21.52 S3.5
N$21
  Top 0.254: R27.2 71.35,21.23 S3.4
N$22
  Top 0.203: U4.P$26 82.91,60.09 81.89,61.11 C20.1
  Top 0.813: C20.1 C21.1
N$23
  Top 0.203: R8.2 75.96,59.03
  Top 0.813: 75.96,59.03 C21.2
N$24
  Top 0.203: X7.10 84.85,13.97 75.33,13.97 X7.4 | 75.18,13.83 X7.4 | U14.6 76.94,25.94 76.45,26.42 74.17,26.42 72.39,24.64 69.09,24.64 67.92,23.47 S3.2 67.82,23.44 67.82,23.37 67.56,23.37 66.29,22.1 66.29,19.05 67.56,17.78 69.34,17.78 74.17,12.95 74.06,12.84 X7.4
N$25
  Bottom 0.203: X7.5 76.09,11.68 86.12,11.68 X7.11
N$26
  Bottom 0.203: X7.12 86.88,13.97 77.36,13.97 X7.6
N$27
  Top 0.203: 78.92,18.94 C43.2
  Top 0.254: 76.87,21.21 R27.1
  Top 0.406: 76.87,21.21 R28.1 78.92,18.94
N$28
  Top 0.254: 7.92,16.05 7.98,16 R10.1 8.33,15.84 | 6.28,16.05 R9.2 | U8.8 8.27,13.14 8.33,13.21
  Top 0.406: 7.92,16.05 6.28,16.05 | 8.33,13.21 8.33,15.84
N$29
  Top 0.254: 10.66,4.32 R14.2 | 10.55,4.43 10.66,4.32 | 10.66,4.32 10.67,4.32 | R13.2 8.42,4.14 8.27,4.29
  Top 0.406: 8.42,4.14 R14.2 | 8.27,4.29 U8.1
N$30
  Top 0.203: 37.05,78.71 36.83,78.49 +5V.C
  Top 0.406: R17.2 37.05,79.95 37.05,78.71
N$31
  Top 0.254: R28.2 69.81,18.94 S3.1
N$32
  Top 0.203: U9.2 22.88,21.67
  Top 0.254: 22.88,21.67 C26.1
N$33
  Top 0.203: 11.8,2.27 11.8,4.97 11.8,5.2 11.17,5.84 10.16,5.84 9.54,6.46 U8.2 | 12.24,1.83 12.23,1.84 C25.1
  Top 0.254: 11.8,2.27 12.24,1.83
N$34
  Top 0.305: 91.32,78.88 91.4,78.95 | R18.1 91.4,78.95 | 91.4,78.95 91.44,78.99
  Top 0.61: +3.6V.C 91.32,78.88
N$35
  Top 0.254: 25.09,22.94 R16.2
  Top 0.406: U9.1 25.09,22.94 | R15.2 26.81,24.66 R16.2
N$36
  Top 0.203: 35.61,24.87 35.61,25.43 R11.2
  Top 0.254: U9.8 32.94,22.94 33.02,22.86 | 35.3,22.86 R12.1 | 35.54,24.8 35.61,24.87
  Top 0.406: 33.02,22.86 35.3,22.86 | R12.1 35.54,24.8
N$39
  Top 0.254: 92.61,87.27 90.93,85.6 89.41,85.6 88.01,84.2 U12.11
  Top 0.406: R29.2 92.61,87.27
N$40
  Top 0.254: 90.07,87.27 88.39,85.6 87.88,85.6 86.74,84.45 U12.12
  Top 0.406: R30.2 90.07,87.27
N$41
  Top 0.254: 87.53,87.27 85.47,85.22 U12.13
  Top 0.406: R31.2 87.53,87.27
N$42
  Top 0.254: R32.2 84.2,86.5 U12.14
N$43
  Top 0.254: R33.2 82.93,86.78 U12.15
N$44
  Top 0.254: 79.88,87 81.66,85.22 U12.16
  Top 0.406: R34.2 79.88,87
N$45
  Top 0.254: 77.34,87 78.74,85.6 79.25,85.6 80.39,84.45 U12.17
  Top 0.406: R35.2 77.34,87
N$47
  Top 0.406: LED11.A | LED11.A | LED11.A 74.93,91.19
  Top 0.813: R36.1 LED11.A
N$48
  Top 0.813: R35.1 LED10.A
N$49
  Top 0.813: R34.1 LED9.A
N$50
  Top 0.813: R33.1 LED8.A
N$51
  Top 0.813: R32.1 LED7.A
N$52
  Top 0.813: R31.1 LED6.A
N$53
  Top 0.813: R30.1 LED5.A
N$54
  Top 0.813: R29.1 LED4.A
PA0
  Top 0.203: 77.72,72.97 77.72,74.42 77.22,74.93 75.44,74.93 71.88,78.49 64.77,78.49 57.93,71.65 U3.57
  Top 0.254: U12.2 77.72,72.97
PA1
  Top 0.203: 79.12,74.55 U12.3 79.12,75.06 78.49,75.69 75.44,75.69 72.14,78.99 64.52,78.99 57.28,71.76 U3.58
PA2
  Top 0.203: U12.4 80.39,75.56 79.5,76.45 75.44,76.45 72.39,79.5 64.26,79.5 56.63,71.88 U3.59
PA3
  Top 0.203: U12.5 81.66,75.82 80.26,77.22 75.44,77.22 72.64,80.01 64.01,80.01 55.98,71.99 U3.60
PA4
  Top 0.203: U12.6 82.93,75.82 80.77,77.98 75.44,77.98 72.9,80.52 63.75,80.52 55.34,72.1 U3.61
PA5
  Top 0.203: U12.7 84.2,75.82 81.28,78.74 75.44,78.74 73.15,81.03 63.5,81.03 54.68,72.21 U3.62
PA6
  Top 0.203: U12.8 85.47,75.82 81.79,79.5 75.44,79.5 73.41,81.53 63.25,81.53 54.03,72.32 U3.63
PA7
  Top 0.203: U12.9 86.74,75.82 82.3,80.26 75.44,80.26 73.66,82.04 62.99,82.04 53.38,72.44 U3.64
PAD7  (via drill 0.2)
  Top 0.203: U3.81 42.34,76.88 v42.32,76.99
  Bottom 0.203: v42.32,76.99 42.32,77.14 46.99,81.79 65.28,81.79 69.79,86.3 EXP.1
PAD8  (via drill 0.2)
  Top 0.203: U3.68 50.78,75.68 v50.8,75.69
  Bottom 0.203: v50.8,75.69 52.58,77.47 97.11,77.47 EXP.10
PAD9  (via drill 0.2)
  Top 0.203: U3.70 49.48,74.88 v49.48,74.91
  Bottom 0.203: v49.48,74.91 49.48,75.39 52.83,78.74 95.84,78.74 EXP.7
PAD10  (via drill 0.2)
  Top 0.203: U3.72 48.18,75.87 v49.02,76.71
  Bottom 0.203: v49.02,76.71 51.56,79.25 70.36,79.25 71.12,80.01 97.11,80.01 EXP.8
PAD11  (via drill 0.2)
  Top 0.203: U3.74 46.88,76.86 v46.99,76.96
  Bottom 0.203: v46.99,76.96 46.99,78.74 48.01,79.76 69.34,79.76 70.81,81.22 EXP.5
PAD12  (via drill 0.2)
  Top 0.203: U3.76 45.59,75.83 45.59,76.12 v45.59,76.12
  Bottom 0.203: EXP.6 97.11,82.55 70.61,82.55 68.33,80.26 47.75,80.26 45.97,78.49 45.59,78.11 45.59,77.98 v45.59,76.12
PAD13  (via drill 0.2)
  Top 0.203: U3.78 44.28,76.87 v44.27,76.71
  Bottom 0.203: v44.27,76.71 44.27,77.55 47.5,80.77 67.31,80.77 70.3,83.76 EXP.3
PAD14  (via drill 0.2)
  Top 0.203: U3.80 42.98,75.38 v42.98,75.84
  Bottom 0.203: v42.98,75.84 42.98,77.04 47.24,81.28 66.29,81.28 70.1,85.09 97.11,85.09 EXP.4
PAD15  (via drill 0.2)
  Top 0.203: U3.82 41.68,76.17 v41.66,76.2
  Bottom 0.203: v41.66,76.2 41.66,77.22 46.74,82.3 64.26,82.3 69.6,87.63 97.28,87.63 98.55,86.36 98.5,86.36 EXP.2
PB0  (via drill 0.2)
  Top 0.203: v61.72,45.97 56.9,45.97 55.34,47.53 U3.24
  Bottom 0.203: v61.72,45.97 63.5,45.97 65.79,48.26 95.25,48.26 95.31,48.2 EXP.31
PB1  (via drill 0.2)
  Top 0.203: v61.21,46.74 57.15,46.74 55.98,47.9 U3.25
  Bottom 0.203: EXP.32 97.11,49.53 66.04,49.53 63.25,46.74 v61.21,46.74
PB2  (via drill 0.2)
  Top 0.203: v60.71,47.5 57.4,47.5 56.63,48.27 U3.26
  Bottom 0.203: EXP.29 95.7,50.55 66.04,50.55 62.99,47.5 v60.71,47.5
PB3  (via drill 0.2)
  Top 0.203: U3.27 57.28,48.63 57.66,48.26 v60.2,48.26
  Bottom 0.203: EXP.30 97.11,52.07 94.74,52.07 93.98,51.31 65.79,51.31 62.74,48.26 v60.2,48.26
PB4  (via drill 0.2)
  Top 0.203: v60.04,49.63 U3.28
  Bottom 0.203: EXP.27 94.43,53.28 93.22,52.07 65.53,52.07 63.09,49.63 v60.04,49.63
PB5  (via drill 0.2)
  Top 0.203: U3.29 60.81,51.45 v61.21,51.05
  Bottom 0.203: EXP.28 97.11,54.61 94.23,54.61 92.46,52.83 65.28,52.83 63.5,51.05 v61.21,51.05
PB6  (via drill 0.2)
  Top 0.203: U3.30 61.69,52.1 v61.98,51.82
  Bottom 0.203: EXP.25 93.92,55.82 91.69,53.59 65.02,53.59 63.25,51.82 v61.98,51.82
PB7  (via drill 0.2)
  Top 0.203: U3.31 62.31,52.75 v62.48,52.58
  Bottom 0.203: EXP.26 97.11,57.15 93.73,57.15 90.93,54.36 64.26,54.36 v62.48,52.58
PE0  (via drill 0.2)
  Top 0.203: U3.56 60.37,69 60.45,69.09 v60.45,72.39
  Bottom 0.203: EXP.9 64.2,76.14 v60.45,72.39
PE1  (via drill 0.2)
  Top 0.203: U3.55 60.48,68.35 61.21,69.09 v61.21,71.88
  Bottom 0.203: EXP.12 97.11,74.93 64.26,74.93 v61.21,71.88
PE2  (via drill 0.2)
  Top 0.203: v61.98,71.37 61.98,69.09 60.6,67.72 U3.54
  Bottom 0.203: EXP.11 63.95,73.6 61.98,71.63 v61.98,71.37
PE3  (via drill 0.2)
  Top 0.203: U3.53 60.7,67.05 62.74,69.09 v62.74,70.87
  Bottom 0.203: EXP.14 97.11,72.39 95,72.39 94.74,72.64 64.52,72.64 v62.74,70.87
PE4  (via drill 0.2)
  Top 0.254: U3.39 61.43,57.95 v61.47,57.91
  Bottom 0.203: v61.47,57.91 64.26,55.12 90.17,55.12 93.41,58.36 EXP.23
PH0  (via drill 0.2)
  Top 0.203: U3.52 60.82,66.4 63.5,69.09 v63.5,70.36
  Bottom 0.203: v63.5,70.36 65.02,71.88 94.49,71.88 95.25,71.12 EXP.13
PH1  (via drill 0.2)
  Top 0.203: U3.51 60.93,65.75 64.26,69.09 v64.26,69.85
  Bottom 0.203: EXP.16 97.11,69.85 95.25,69.85 93.98,71.12 65.53,71.12 v64.26,69.85
PH2  (via drill 0.2)
  Top 0.203: U3.50 61.04,65.1 65.02,69.09 v65.02,69.34
  Bottom 0.203: EXP.15 95.31,68.52 93.47,70.36 66.04,70.36 v65.02,69.34
PH3  (via drill 0.2)
  Top 0.203: U3.49 61.15,64.45 65.53,68.83 v65.79,68.83
  Bottom 0.203: EXP.18 97.11,67.31 95.25,67.31 92.96,69.6 66.55,69.6 v65.79,68.83
PH4
  Top 0.203: U3.35 64.28,55.35 65.02,54.61 65.02,53.09 65.51,52.6 U13.2
PH5
  Top 0.203: U3.34 63.91,54.7 64.52,54.1 64.52,52.32 65.51,51.33 U13.3
PH6
  Top 0.203: U3.33 63.55,54.05 64.01,53.59 64.01,51.56 65.51,50.06 U13.4
PH7
  Top 0.203: U3.32 63.18,53.4 63.5,53.09 63.5,50.8 65.51,48.79 U13.5
PK1  (via drill 0.2)
  Top 0.203: 9.47,13.2 9.47,17.53 10.24,18.29 14.22,18.29 v22.35,26.42 | 32.77,21.67 37.08,21.67 37.34,21.92 v37.34,26.67 | U3.7 44.28,48.09 43.43,47.24 v43.43,46.74
  Top 0.254: U8.7 9.47,13.2 | U9.7 32.77,21.67
  Bottom 0.203: v43.43,46.74 41.15,44.45 41.15,30.48 v37.34,26.67 37.08,26.42 v22.35,26.42
PK2  (via drill 0.2)
  Top 0.203: U3.6 43.63,48.46 v43.18,48.01 | U7.5 21.36,28.17 v21.59,27.94
  Bottom 0.203: v21.59,27.94 23.11,27.94 v43.18,48.01
PK7  (via drill 0.2)
  Top 0.203: U3.108 35.77,54.05 v35.31,53.59 | 28.09,67.86 R25.1
  Top 0.813: S2.2 28.09,67.86
  Bottom 0.203: v35.31,53.59 35.05,53.34 11.68,53.34 10.92,54.1 10.92,58.67 14.48,62.23 23.88,62.23 26.42,64.77 26.42,66.29 24.89,67.82 S2.2
PS0  (via drill 0.2)
  Top 0.203: U3.89 35.96,66.4 v35.31,67.06
  Bottom 0.203: v35.31,67.06 59.18,67.06 60.45,65.79 93.22,65.79 95.5,63.5 95.76,63.5 95.82,63.44 EXP.19
PS1  (via drill 0.2)
  Top 0.203: U3.90 35.34,65.75 v34.8,66.29
  Bottom 0.203: v34.8,66.29 58.93,66.29 59.94,65.28 91.95,65.28 95,62.23 97.03,62.23 98.36,60.9 EXP.22
PS2  (via drill 0.2)
  Top 0.203: U3.91 34.72,65.1 v34.29,65.53
  Bottom 0.203: v34.29,65.53 58.67,65.53 59.44,64.77 91.19,64.77 95,60.96 95.84,60.96 EXP.21
PS3  (via drill 0.2)
  Top 0.203: U3.92 34.1,64.45 v33.78,64.77
  Bottom 0.203: v33.78,64.77 58.42,64.77 58.93,64.26 90.42,64.26 95,59.69 97.03,59.69 98.36,58.36 EXP.24
PWM0
  Top 0.203: EXP.33 82.49,45.66 73.15,36.32 46.57,36.32 42.34,40.56 U3.4
PWM1
  Top 0.203: EXP.34 98.44,45.61 97.28,44.45 82.04,44.45 73.41,35.81 46.23,35.81 41.68,40.36 U3.3
PWM2
  Top 0.203: EXP.35 81.48,43.12 73.66,35.31 45.97,35.31 41.03,40.25 U3.2
PWM3
  Top 0.203: U3.1 40.38,40.13 45.72,34.8 73.91,34.8 81.03,41.91 97.23,41.91 EXP.36
PWM4
  Top 0.203: EXP.37 80.46,40.58 74.17,34.29 45.47,34.29 38.61,41.15 38.61,51.41 U3.112
PWM5
  Top 0.203: U3.111 37.37,52.1 36.83,51.56 36.83,42.16 45.21,33.78 74.42,33.78 80.01,39.37 97.23,39.37 EXP.38
PWM6
  Top 0.203: U3.110 37.01,52.75 36.32,52.07 36.32,41.91 44.96,33.27 74.68,33.27 79.44,38.04 EXP.39
PWM7
  Top 0.203: U3.109 36.64,53.4 35.81,52.58 35.81,41.66 44.7,32.77 74.93,32.77 78.99,36.83 97.28,36.83 98.44,37.99 EXP.40
RESET  (via drill 0.2)
  Top 0.203: U3.42 62.02,59.9 62.99,58.93 66.04,58.93 66.29,58.67 v67.06,58.67 | X6.4 65.28,39.62 65.28,38.1 64.26,37.08 59.18,37.08 57.91,38.35 R7.1 | 53.58,38.42 53.51,38.35
  Top 0.813: S1.6 53.51,38.35 S1.3 | R7.1 53.58,38.42
  Bottom 0.203: v67.06,58.67 66.55,59.18 60.96,59.18 58.93,57.15 58.93,43.69 59.94,42.67 62.23,42.67 X6.4
RXCAN0
  Top 0.203: U3.105 30.86,56 29.72,54.86 29.72,46.23 43.94,32 70.1,32 72.14,29.97 75.54,29.97 U14.4
RXCAN1
  Top 0.203: U3.103 30.63,57.3 28.7,55.37 28.7,45.21 42.93,30.99 54.86,30.99 58.98,26.87 U5.4 60.96,25.65
RXCAN2
  Top 0.203: U3.101 30.41,58.6 27.69,55.88 27.69,44.2 45.47,26.42 46.41,26.42 U6.4
RXCAN3  (via drill 0.2)
  Top 0.203: U3.88 36.58,67.05 v35.81,67.82
  Bottom 0.203: v35.81,67.82 59.44,67.82 60.96,66.29 93.73,66.29 95.25,64.77 97.03,64.77 98.36,63.44 EXP.20
SCK0
  Top 0.203: U3.95 10.43,62.5 7.11,59.18 7.11,52.58 13.21,46.48 13.21,32 14.69,30.52 U7.3
SCL0
  Top 0.203: U3.98 19.15,60.55 18.03,59.44 18.03,58.17 18.47,57.73 U11.3 21.01,57.73 21.08,57.66 25.4,57.66 25.65,57.4 R21.1
SCL_3.6V  (via drill 0.2)
  Top 0.203: U4.P$13 91.84,60.09 v91.95,60.2 | U4.P$4 86.22,57.01 v86.11,56.9 | U11.6 14.85,57.66 9.52,57.66 R24.1 9.35,58.88 11.43,60.96 17.02,60.96 v17.27,60.71
  Bottom 0.203: v91.95,60.2 89.41,60.2 v86.11,56.9 85.34,57.66 70.61,57.66 67.56,60.71 v17.27,60.71
SDA0
  Top 0.203: U3.99 24.85,59.9 23.37,58.42 R22.1 23.37,58.67 23.04,59
  Top 0.406: U11.4 23.04,59
SDA_3.6V  (via drill 0.2)
  Top 0.203: U4.P$9 89.22,56.57 v89.66,56.13 | v84.84,56.64 84.42,57.06 U4.P$1 | R23.1 12.08,59 U11.5 14.99,58.94 14.99,58.93 14.73,59.18 v14.73,59.94
  Bottom 0.203: v89.66,56.13 85.34,56.13 v84.84,56.64 84.58,56.9 70.36,56.9 67.31,59.94 v14.73,59.94
SS0
  Top 0.203: U3.96 10.55,61.85 7.62,58.93 7.62,53.09 13.97,46.74 13.97,32.26 14.44,31.79 U7.2
TD
  Top 0.406: R11.1 33.44,26.5 31.5,28.45 28.19,28.45 23.58,33.06 U7.8
TD+
  Top 0.203: R16.1 24.74,20.42 24.64,20.32
  Top 0.254: 25.91,19.13 25.83,19.13
  Top 0.406: U9.4 25.91,19.13 25.91,13.72 33.02,6.6 37.59,6.6 38.38,7.39 X5.5 | 25.83,19.13 24.64,20.32
TD-
  Top 0.406: U9.5 33.95,19.13 | 33.95,19.13 34.37,19.13 35.56,20.32 35.54,20.34 R12.2 | 33.95,19.13 39.4,12.93 X5.4
TG
  Top 0.406: R9.1 4.36,17.32 6.1,19.05 12.95,19.05 18.54,24.64 18.54,29.21 19.85,30.52 U7.6
TG+
  Top 0.203: 12.95,3.81 12.95,3.93 R14.1
  Top 0.254: 12.7,4.18 R14.1
  Top 0.406: U8.4 12.08,6.46 12.7,5.84 12.7,4.18 | X5.17 22.63,6.88 18.29,2.54 14.22,2.54 12.95,3.81
TG-
  Top 0.254: 10.36,16.05 10.36,16.02 R10.2 | U8.5 11.94,13.2 11.94,13.21
  Top 0.406: 10.36,16.05 12.08,14.34 U8.5 20.44,13.06 X5.16
TXCAN0
  Top 0.203: U3.104 30.75,56.65 29.21,55.12 29.21,45.72 43.43,31.5 69.6,31.5 73.15,27.94 78.99,27.94 79.48,28.42 U14.1
TXCAN1
  Top 0.203: U3.102 30.52,57.95 28.19,55.63 28.19,44.7 42.42,30.48 54.36,30.48 59.94,24.89 64.26,24.89 64.77,25.4 U5.1
TXCAN2
  Top 0.203: U3.100 30.3,59.25 27.18,56.13 27.18,43.69 43.94,26.92 43.94,25.65 45.21,24.38 49.78,24.38 50.27,24.87 U6.1
TXCAN3  (via drill 0.2)
  Top 0.203: U3.87 37.2,67.7 v36.32,68.58
  Bottom 0.203: EXP.17 95.31,65.98 95.25,66.04 94.57,66.8 61.47,66.8 59.69,68.58 v36.32,68.58
VREF2
  Top 0.61: C37.1 R20.1 14.93,53.6 U11.8 U11.7

## Text on the board
tNames: Freins | Accel | TCS | Vsync | Err | CAN | INS | AccErr | Off | TCS | 5 A | Simon Shink | 2012 | V1.0 | Contrôleur de propulsion | Term off | ELE3000
tDocu: Reset